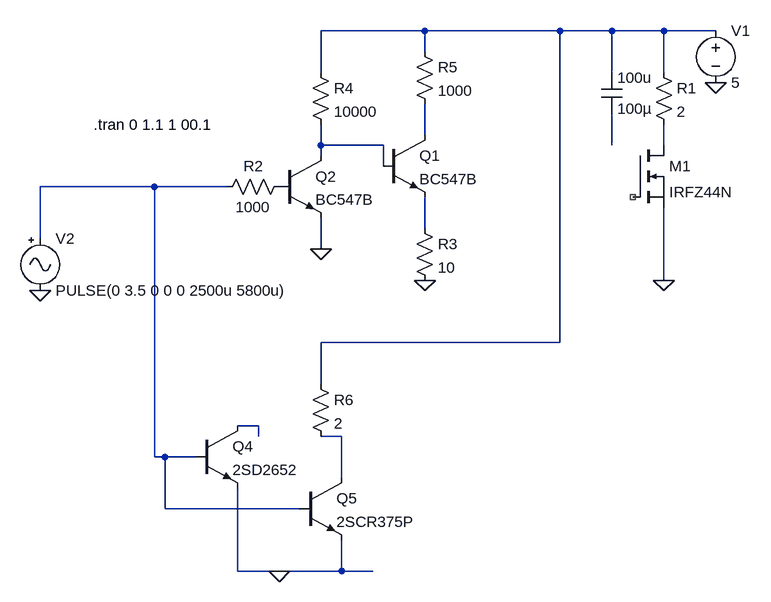
[diagram p0: schematic Draft6.asc]
Draft6.asc, the LTspice schematic file:
Version 4
SHEET 1 880 804
WIRE -128 -80 -288 -80
WIRE 80 -80 -128 -80
WIRE 160 -80 80 -80
WIRE 240 -80 160 -80
WIRE 320 -80 240 -80
WIRE -128 -48 -128 -80
WIRE -288 -16 -288 -80
WIRE 160 -16 160 -80
WIRE 240 -16 240 -80
WIRE -128 80 -128 32
WIRE -288 96 -288 64
WIRE -192 96 -288 96
WIRE 160 96 160 48
WIRE 240 96 240 64
WIRE -288 112 -288 96
WIRE -192 128 -192 96
WIRE -544 160 -720 160
WIRE -432 160 -544 160
WIRE -128 224 -128 176
WIRE -720 240 -720 160
WIRE -288 256 -288 208
WIRE 240 304 240 192
WIRE 80 400 80 -80
WIRE 80 400 -288 400
WIRE -288 464 -288 400
WIRE -384 528 -416 528
WIRE -384 544 -384 528
WIRE -256 544 -288 544
WIRE -544 576 -544 160
WIRE -528 576 -544 576
WIRE -480 576 -528 576
WIRE -256 608 -256 544
WIRE -528 656 -528 576
WIRE -320 656 -528 656
WIRE -416 752 -416 624
WIRE -352 752 -416 752
WIRE -256 752 -256 704
WIRE -256 752 -352 752
WIRE -208 752 -256 752
FLAG -720 320 0
FLAG 320 0 0
FLAG -288 256 0
FLAG 240 304 0
FLAG -128 304 0
FLAG -352 752 0
SYMBOL nmos 192 96 R0
SYMATTR InstName M1
SYMATTR Value IRFZ44N
SYMBOL voltage 320 -96 R0
WINDOW 123 0 0 Left 0
WINDOW 39 0 0 Left 0
SYMATTR InstName V1
SYMATTR Value 5
SYMBOL Misc\\signal -720 224 R0
WINDOW 123 0 0 Left 0
WINDOW 39 0 0 Left 0
SYMATTR InstName V2
SYMATTR Value PULSE(0 3.5 0 0 0 2500u 5800u)
SYMBOL res -304 -32 R0
SYMATTR InstName R4
SYMATTR Value 10000
SYMBOL res -336 144 R90
WINDOW 0 0 56 VBottom 2
WINDOW 3 32 56 VTop 2
SYMATTR InstName R2
SYMATTR Value 1000
SYMBOL npn -192 80 R0
SYMATTR InstName Q1
SYMATTR Value BC547B
SYMBOL npn -352 112 R0
SYMATTR InstName Q2
SYMATTR Value BC547B
SYMBOL res -144 -64 R0
SYMATTR InstName R5
SYMATTR Value 1000
SYMBOL res 224 -32 R0
SYMATTR InstName R1
SYMATTR Value 2
SYMBOL cap 144 -16 R0
SYMATTR InstName 100u
SYMATTR Value 100µ
SYMBOL res -144 208 R0
SYMATTR InstName R3
SYMATTR Value 10
SYMATTR SpiceLine tol=1 pwr=0.1
SYMBOL npn -480 528 R0
SYMATTR InstName Q4
SYMATTR Value 2SD2652
SYMBOL res -304 448 R0
SYMATTR InstName R6
SYMATTR Value 2
SYMBOL npn3 -320 608 R0
SYMATTR InstName Q5
SYMATTR Value 2SCR375P
TEXT -638 64 Left 2 !.tran 0 1.1 1 00.1

The netlist it stands for:
* Draft6.asc
M1 N005 NC_01 0 0 IRFZ44N
V1 N001 0 5
V2 N006 0 PULSE(0 3.5 0 0 0 2500u 5800u)
R4 N001 N003 10000
R2 P001 N006 1000
Q1 N002 N003 N007 0 BC547B
Q2 N003 P001 0 0 BC547B
R5 N001 N002 1000
R1 N001 N005 2
C§100u N001 N004 100µ
R3 N007 0 10 tol=1 pwr=0.1
Q4 N008 N006 0 0 2SD2652
R6 N001 N009 2
Q5 N009 N006 0 0 2SCR375P
.model NPN NPN
.model PNP PNP
.lib standard.bjt
.model NMOS NMOS
.model PMOS PMOS
.lib standard.mos
.tran 0 1.1 1 00.1
.backanno
.end